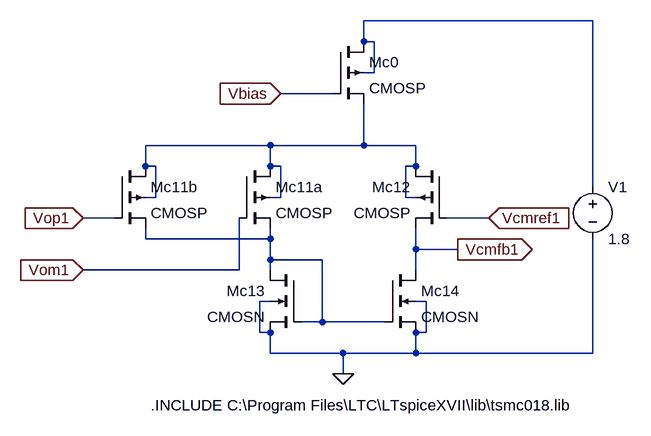
[diagram p0: schematic Stage1CommonModeFeedback.asc]
Stage1CommonModeFeedback.asc, the LTspice schematic file:
Version 4
SHEET 1 1048 680
WIRE 752 -48 400 -48
WIRE 400 -16 400 -48
WIRE 416 -16 400 -16
WIRE 416 32 416 -16
WIRE 416 32 400 32
WIRE 352 64 272 64
WIRE 256 144 64 144
WIRE 400 144 400 80
WIRE 400 144 256 144
WIRE 480 144 400 144
WIRE 64 176 64 144
WIRE 80 176 64 176
WIRE 256 176 256 144
WIRE 272 176 256 176
WIRE 480 176 480 144
WIRE 480 176 464 176
WIRE 752 208 752 -48
WIRE 80 224 80 176
WIRE 80 224 64 224
WIRE 272 224 272 176
WIRE 272 224 256 224
WIRE 464 224 464 176
WIRE 480 224 464 224
WIRE 16 256 -32 256
WIRE 592 256 528 256
WIRE 64 288 64 272
WIRE 256 288 256 272
WIRE 256 288 64 288
WIRE 480 304 480 272
WIRE 544 304 480 304
WIRE 256 320 256 288
WIRE 336 320 256 320
WIRE 208 336 208 256
WIRE 208 336 -32 336
WIRE 256 336 256 320
WIRE 480 336 480 304
WIRE 256 384 240 384
WIRE 496 384 480 384
WIRE 336 416 336 320
WIRE 336 416 304 416
WIRE 432 416 336 416
WIRE 240 432 240 384
WIRE 256 432 240 432
WIRE 496 432 496 384
WIRE 496 432 480 432
WIRE 256 464 256 432
WIRE 368 464 256 464
WIRE 480 464 480 432
WIRE 480 464 368 464
WIRE 752 464 752 288
WIRE 752 464 480 464
WIRE 368 496 368 464
FLAG 368 496 0
FLAG -32 256 Vop1
IOPIN -32 256 In
FLAG -32 336 Vom1
IOPIN -32 336 In
FLAG 592 256 Vcmref1
IOPIN 592 256 In
FLAG 272 64 Vbias
IOPIN 272 64 In
FLAG 544 304 Vcmfb1
IOPIN 544 304 Out
SYMBOL voltage 752 192 R0
WINDOW 123 0 0 Left 2
WINDOW 39 0 0 Left 2
SYMATTR InstName V1
SYMATTR Value 1.8
SYMBOL pmos4 528 176 M0
SYMATTR InstName Mc12
SYMATTR Value CMOSP
SYMATTR Value2 l=0.18µ w=0.414µ ad=0.14904p as=0.14904p pd=1.548µ ps=1.548µ
SYMBOL nmos4 432 336 R0
SYMATTR InstName Mc14
SYMATTR Value CMOSN
SYMATTR Value2 l=0.4173913043µ w=0.24µ ad=0.0864p as=0.0864p pd=1.2µ ps=1.2µ
SYMBOL pmos4 208 176 R0
SYMATTR InstName Mc11a
SYMATTR Value CMOSP
SYMATTR Value2 l=0.2086956522µ w=0.24µ ad=0.0864p as=0.0864p pd=1.2µ ps=1.2µ
SYMBOL pmos4 352 -16 R0
SYMATTR InstName Mc0
SYMATTR Value CMOSP
SYMATTR Value2 l=0.18µ w=0.828µ ad=0.29808p as=0.29808p pd=2.376µ ps=2.376µ
SYMBOL pmos4 16 176 R0
SYMATTR InstName Mc11b
SYMATTR Value CMOSP
SYMATTR Value2 l=0.2086956522µ w=0.24µ ad=0.0864p as=0.0864p pd=1.2µ ps=1.2µ
SYMBOL nmos4 304 336 M0
SYMATTR InstName Mc13
SYMATTR Value CMOSN
SYMATTR Value2 l=0.4173913043µ w=0.24µ ad=0.0864p as=0.0864p pd=1.2µ ps=1.2µ
TEXT 72 544 Left 2 !.INCLUDE C:\\Program Files\\LTC\\LTspiceXVII\\lib\\tsmc018.lib

The netlist it stands for:
* Stage1CommonModeFeedback.asc
V1 N001 0 1.8
Mc12 N002 Vcmref1 Vcmfb1 N002 CMOSP l=0.18µ w=0.414µ ad=0.14904p as=0.14904p pd=1.548µ ps=1.548µ
Mc14 Vcmfb1 N003 0 0 CMOSN l=0.4173913043µ w=0.24µ ad=0.0864p as=0.0864p pd=1.2µ ps=1.2µ
Mc11a N002 Vom1 N003 N002 CMOSP l=0.2086956522µ w=0.24µ ad=0.0864p as=0.0864p pd=1.2µ ps=1.2µ
Mc0 N001 Vbias N002 N001 CMOSP l=0.18µ w=0.828µ ad=0.29808p as=0.29808p pd=2.376µ ps=2.376µ
Mc11b N002 Vop1 N003 N002 CMOSP l=0.2086956522µ w=0.24µ ad=0.0864p as=0.0864p pd=1.2µ ps=1.2µ
Mc13 N003 N003 0 0 CMOSN l=0.4173913043µ w=0.24µ ad=0.0864p as=0.0864p pd=1.2µ ps=1.2µ
.model NMOS NMOS
.model PMOS PMOS
.lib standard.mos
.INCLUDE C:\Program Files\LTC\LTspiceXVII\lib\tsmc018.lib
.backanno
.end